# Altium project Microneedle_Patch_Panel.PrjPcb
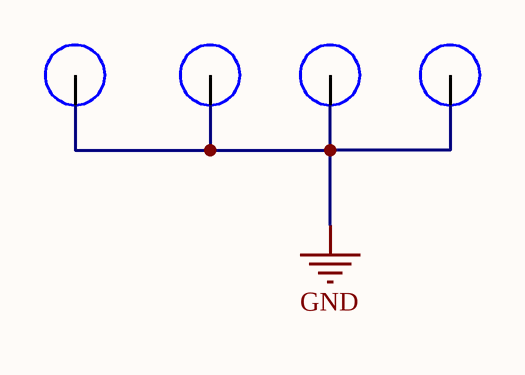
[diagram p0: Microneedle_Patch_Panel.SchDoc]
Project_Date: 20XX-XX-XX; Project_DateCode: DCXXXX; Project_Designer1: Enter Name; Project_Designer2: Enter Name; Project_Designer3: Enter Name; Project_Designer4: Enter Name; Project_Global: Global Project; Project_Group: Group Name; Project_Name: Project Name; Project_Revision: X.XXX; Project_Stencil_Bot_Thickness: 0.1 MM; Project_Stencil_Top_Thickness: 0.1 MM
1 sheet, 4 parts. Net scope: flat (ports and power ports of the same name join across sheets).
Board file: Microneedle_Patch_Panel.PcbDoc

## Sheet Microneedle_Patch_Panel.SchDoc
size Tabloid; SheetNumber: 1; SheetTotal: 1; Sheet_Name: Insert name in Document Parameters; Size: 11x17

### Parts
MH1  2 mm  [MH_2MM]  (value not drawn)
MH2  2 mm  [MH_2MM]  (value not drawn)
MH3  2 mm  [MH_2MM]  (value not drawn)
MH4  2 mm  [MH_2MM]  (value not drawn)

### Nets
GND: MH1.1 MH2.1 MH3.1 MH4.1

### Notes on the sheet
- Sheet Name
- Project Title
- Global Project
- Size
- Group
- Revision
- Date
- Sheet
- of
- Filename
- Designers

### Library data of the parts
MH1-MH4 = MH_2MM: Mounting Hole - 2 mm